# Altium schematic sheet Amplifier.SchDoc: Audio_Moduloop - Amplifier
size A; Date: 2/27/2024; DrawnBy: Team 28: Ryan Gordon, Conor Curtin, Evan Roveili, Shawn Colby; DocumentNumber: 5; Revision: V1; SheetNumber: 5; SheetTotal: 7
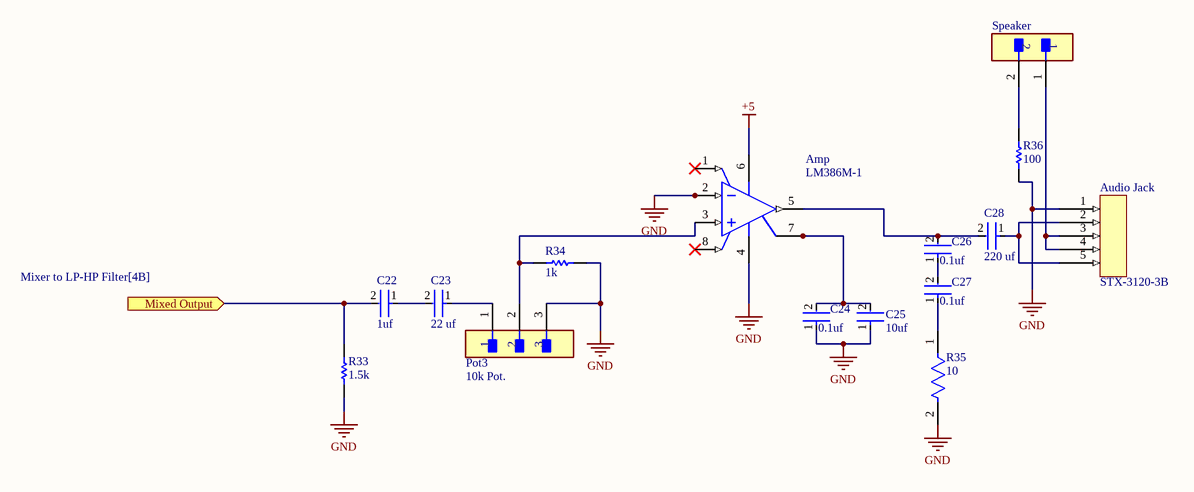
[diagram p0: Amplifier.SchDoc]

## Parts
Amp  LM386M-1  [TI-D8_M]
Audio_Jack  STX-3120-3B  [STX3100]
C22  1uf  [FP-K105Z20Y5VF5TL2-MFG]
C23  22 uf  [FP-RCEWM1-MFG]
C24  0.1uf  [FP-SR20-MFG]
C25  10uf  [FP-RCE3DB-MFG]
C26  0.1uf  [FP-SR20-MFG]
C27  0.1uf  [FP-SR20-MFG]
C28  220 uf  [FP-RCEWM1-MFG]
Pot3  10k Pot.  [FP-90120-0123-MFG]
R33  1.5k  [RESC2013X60X40LL20T25]
R34  1k  [RESC2013X70X40ML20T20]
R35  10  [FP-RN732A-MFG]
R36  100  [RESC2013X60X40ML20T25]
Speaker  M20-9990246  [FP-M20-9990246-MFG]  (value not drawn)

## Ports
Mixed Output (in, see Mixer to LP-HP Filter[4B])

## Nets
+5: Amp.6(VS)
GND: Amp.2(IN-) Amp.4(GND) Audio_Jack.1 C24.1 C25.1 Pot3.3 R33.1 R34.2 R35.2 R36.1
Mixed Output: C22.2 R33.2 ; port Mixed Output
NetAmp_3: Amp.3(IN+) Pot3.2 R34.1
NetAmp_5: Amp.5(VOUT) C26.2 C28.2
NetAmp_7: Amp.7(BYPASS) C24.2 C25.2
NetAudio_Jack_2: Audio_Jack.2 Audio_Jack.5 C28.1
NetAudio_Jack_3: Audio_Jack.3 Audio_Jack.4 Speaker.1
NetC22_1: C22.1 C23.2
NetC23_1: C23.1 Pot3.1
NetC26_1: C26.1 C27.2
NetC27_1: C27.1 R35.1
NetR36_2: R36.2 Speaker.2

Not connected (* = marked no-connect by the designer): Amp 1(GAIN)* 8(GAIN)*

## Notes on the sheet
- Title
- Size
- Date:
- A
- Drawn By:
- Sheet    of
- Revision
- File:
- Document Number:

## Library data of the parts
Amp = CMP-0994-00001-1: Low Voltage Audio Power Amplifier, 0 to 70 degC, 8-pin SOIC (D8), Green (RoHS & no Sb/Br); PartNumber: LM386M-1/NOPB; Manufacturer: Texas Instruments; Input Type: Analog; SubFamily: Mid/High-Power Amplifier; Max. Number of Speaker Outputs: 1; PackageVersion: 4040047-3/M, 06/2011; ComponentLink2Description: Datasheet; DatasheetVersion: SNAS545A; ComponentLink3URL: http://www.ti.com/litv/pdf/msoi002j; ComponentLink1URL: http://www.ti.com/; Mounting Technology: Surface Mount; Eco-Plan: Green (RoHS & no Sb/Br); ComponentLink3Description: Package Specification; ComponentLink2URL: http://www.ti.com/general/docs/lit/getliterature.tsp?genericPartNumber=LM386&fileType=pdf; PackageDescription: 8-Pin Plastic Small Outline, Body 4.9 x 3.9 mm, Pitch 1.27 mm; ComponentLink1Description: Manufacturer URL; Code_JEDEC: MS-012; PackageReference: D8
Audio_Jack = CMP-00027-00002-2: 3 Pole(s), Female, Solder Terminal, Locking, Jack; Min Operating Temperature: -25°C; Mounting Technology: Board; Max Operating Temperature: 85°C; RoHS Compliant: Yes
C22 = CMP-02417-000003-1: CAP CER 1UF 50V Y5V RADIAL; Manufacturer Part Number: K105Z20Y5VF5TL2; Manufacturer: Vishay BC Components; Tolerance: -20+80%; Material: Ceramic; Capacitance: 1uF; Temperature Characteristic: Y5V; Mouser Description: Multilayer Ceramic Capacitors MLCC - Leaded 1uF 50volts +80/-20% Y5V 2.5mm LS; Lead Free: Yes; RoHS: TRUE; Voltage Rating: 50V; Device Class L1: Passive Components; Octopart: https://octopart.com/k105z20y5vf5tl2-vishay-39475252; Temperature Range Low: -30°C; Digikey Description: CAP CER 1UF 50V Y5V RADIAL; Device Class L2: Capacitors; Temperature: -30°C to +85°C; Package: K105Z20Y5VF5TL2; Temperature Range High: +85°C; ComponentLink2Description: Datasheet; Value: 1uF; Category: Cap; Height: 6.6mm; ComponentLink2URL: https://www.vishay.com/docs/45171/kseries.pdf; Device Class L3: Ceramic Capacitors; Automotive: No
C23 C28 = CMP-06035-003622-1: CAP CER 22UF 25V X7R RADIAL; Tolerance: 20%; Lead Diameter: 0.5mm; Lead/Base Style: Formed Leads; Height - Seated (Max): 0.295inch; Height: 7.5mm; Capacitance: 22uF; Max Operating Temperature: 125°C; Package Quantity: 1500; Case/Package: Radial; Length: 0.217inch; Lead Pitch: 0.197inch; Voltage Rating (DC): 25V; Ratings: AEC-Q200; Mount: Through Hole; Packaging: Tape and Reel; Voltage Rating: 25V; Min Operating Temperature: -55°C; Width: 0.157inch; Resistor Type: Ceramic; Termination: Radial; Dielectric: X7R
C24 C26 C27 = CMP-04427-000013-1: CAP CER 0.1UF 50V X7R RADIAL; Manufacturer Part Number: SR205C104KAR; Manufacturer: AVX; Material: Ceramic; Tolerance: 10%; Capacitance: 100nF; Value: 100nF; Voltage: 50V; Height: 5.08mm; Digikey Description: CAP CER 0.1UF 50V X7R RADIAL; Device Class L2: Capacitors; ComponentLink2URL: http://datasheets.avx.com/SR-Series.pdf; Temperature Range High: +125°C; Lead Free: Yes; Category: Cap; Device Class L1: Passive Components; Temperature: -55°C to +125°C; Voltage Rating: 50V; ComponentLink2Description: Datasheet; RoHS: TRUE; Automotive: No; Octopart: https://octopart.com/sr205c104kar-avx-145048; Mouser Description: Multilayer Ceramic Capacitors MLCC - Leaded 50volts 0.1uF 10% X7R; Temperature Characteristic: X7R; Device Class L3: Ceramic Capacitors; Temperature Range Low: -55°C; Package: SR20
C25 = CMP-06035-005830-1: Cap Ceramic 10uF 25V X7R ±10% Radial 2.5mm +125°C Automotive Ammo Pack; Lead/Base Style: Straight; Lead Diameter: 0.5mm; Case/Package: Radial; Voltage Rating (DC): 25V; Tolerance: 10%; Lead Pitch: 0.098inch; Termination: Radial; Height - Seated (Max): 0.197inch; Resistor Type: Ceramic; Min Operating Temperature: -55°C; Dielectric: X7R; Length: 0.217inch; Voltage Rating: 25V; Width: 0.157inch; Height: 5mm; Packaging: Tape and Reel; Ratings: AEC-Q200; Max Operating Temperature: 125°C; Package Quantity: 1500; Mount: Through Hole; Capacitance: 10uF
Pot3 = CMP-04776-000237-1: CONN HEADER VERT 3POS 2.54MM; Number of Circuits: 3; Max Voltage Rating (DC): 350.35kV; Contact Resistance: 20mR; Gender: Male; Voltage Rating (AC): 350V; Glow Wire Compliant: Non-compliant; Current Rating: 3A; Contact Post Length: 2.9mm; Number of Contacts: 3; Number of Rows: 1; Max Operating Temperature: 125°C; Orientation: Vertical; Number of Positions: 3; Packaging: Tray; Contact Mating Length: 6.75mm; Housing Color: Black; Termination: Solder; Contact Material: Brass; Radiation Hardening: No; Lead Free: Lead Free; Pitch: 2.54mm; RoHS Compliant: Yes; Voltage Rating: 350V; Contact Plating: Tin; Color: Black; Min Operating Temperature: -55°C; Mount: Through Hole; Housing Material: Polyester; Series: 90120; Contact Gender: Male; REACH SVHC: No SVHC
R33 = CMP-2001-00597-1: Manufacturer: Panasonic; Part Number: ERA6AEB152V
R34 = CMP-2001-04375-5: Chip Resistor, 1 KOhm, +/- 1%, 0.125 W, -55 to 155 degC, 0805 (2012 Metric), RoHS, Tape and Reel; Manufacturer: Panasonic; Voltage Rating: 150 V; ComponentLink1URL: http://www.panasonic.com/; ComponentLink2Description: Datasheet; REACH SVHC: Yes; ComponentLink1Description: Manufacturer URL; Length: 2 mm; Height: 0.6 mm; Package Quantity: 1; PackageDescription: 2-Pin Surface Mount Device, Body 2 x 1.25 mm; Packaging: Cut Tape; PackageReference: 0805; Max Operating Temperature: 155 degC; Mounting Technology: Surface Mount; ComponentLink2URL: http://industrial.panasonic.com/cdbs/www-data/pdf/RDA0000/AOA0000C86.pdf; DatasheetVersion: 04/2015; Min Operating Temperature: -55 degC; RoHSCompliant: true; Mount: Surface Mount
R35 = CMP-03211-004731-1: SMD Chip Resistor, Thin Film, 10Ω, 100 V, 0805 [2012 Metric], 100 mW, 0.1%, RN73 Series; Manufacturer: TE Connectivity; Manufacturer Part Number: RN73C2A10RBTG; Power Rating: 0.1W; Temperature Coefficient: 10ppm/°C; Voltage Rating: 100V; Device Class L2: Resistors; octopart_url: https://octopart.com/rn73c2a10rbtg-te+connectivity-21412009; Temperature: -55°C to 155°C; Automotive: No; Temperature Range High: 155°C; Device Class L1: Passive Components; Package: RN732A; Value: 10Ω; Lead Free: Yes; Composition: Thin Film; Ipc Land Pattern Name: RESC200125X55; Resistance: 10Ω; RoHS: TRUE; Height: 0.65mm; Series: RN73; Category: Res; ComponentLink2URL: https://www.te.com/commerce/DocumentDelivery/DDEController?Action=showdoc&DocId=Data+Sheet%7F1773270%7FP%7Fpdf%7FEnglish%7FENG_DS_1773270_P.pdf%7F1676162-2; Device Class L3: Chip SMD Resistors; Octopart: https://octopart.com/rn73c2a10rbtg-te+connectivity-21412009; ComponentLink2Description: Datasheet; Temperature Range Low: -55°C; packaging: 250 cut tape length; Tolerance: 0.1%
R36 = CMP-2001-00580-1: Manufacturer: Panasonic; Part Number: ERA6AEB101V
Speaker = CMP-15831-000009-1: CONN HEADER VERT 2POS 2.54MM; Manufacturer: Harwin; Conn Gender: Male; Conn Orientation: Vertical; Number Of Contacts: 2; Current Rating: 3A; ComponentLink2URL: https://cdn.harwin.com/pdfs/M20-999.pdf; ComponentLink2Description: Datasheet; Package: M20-9990246; Temperature: -40°C to +105°C; Octopart: https://octopart.com/m20-9990246-harwin-2590635; Mouser Description: 2.54mm (0.1") Pitch SIL Vertical PC Tail Pin Header, 6.1mm mating pin height, tin, 2 contacts; Temperature Range High: +105°C; Device Class L1: Connectors; RoHS: TRUE; Automotive: No; Height: 8.99mm; Number Of Rows: 1; Contact Material: Tin,Nickel; Category: Conn; Pitch: 2.54mm; Lead Free: Yes; Digikey Description: CONN HEADER VERT 2POS 2.54MM; Manufacturer Part Number: M20-9990246; Temperature Range Low: -40°C; Device Class L3: unset; Device Class L2: Headers and Wire Housings